# Altium schematic sheet AuxChannels.SchDoc
size A4; SheetNumber: 17; SheetTotal: 17
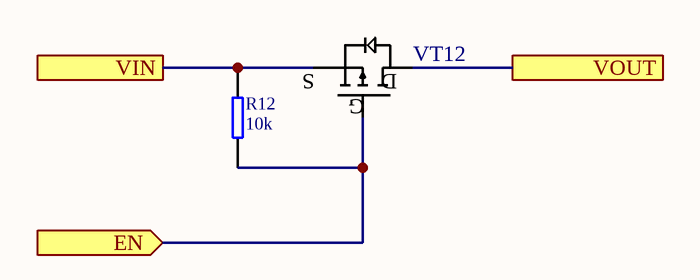
[diagram p0: AuxChannels.SchDoc]

## Parts
R12  value 10k  [RES 0402]
VT12  !Generic P MOSFET  [DFN-8_3x3]  (value not drawn)

## Ports
EN (in), VIN, VOUT

## Nets
EN: R12.1 VT12.G2 ; port EN
VIN: R12.2 VT12.S1 ; port VIN
VOUT: VT12.D1 ; port VOUT

## Notes on the sheet
- (in symbol !Generic P MOSFET) S; D; G

## Library data of the parts
R12 = !Resistor: Resistor; IsSMT: NoSMT
VT12 = !Generic P MOSFET: generic P mosfet; pin to pad: D1>5+6+7+8+TH G2>4 S1>1+2+3; IsSMT: NoSMT